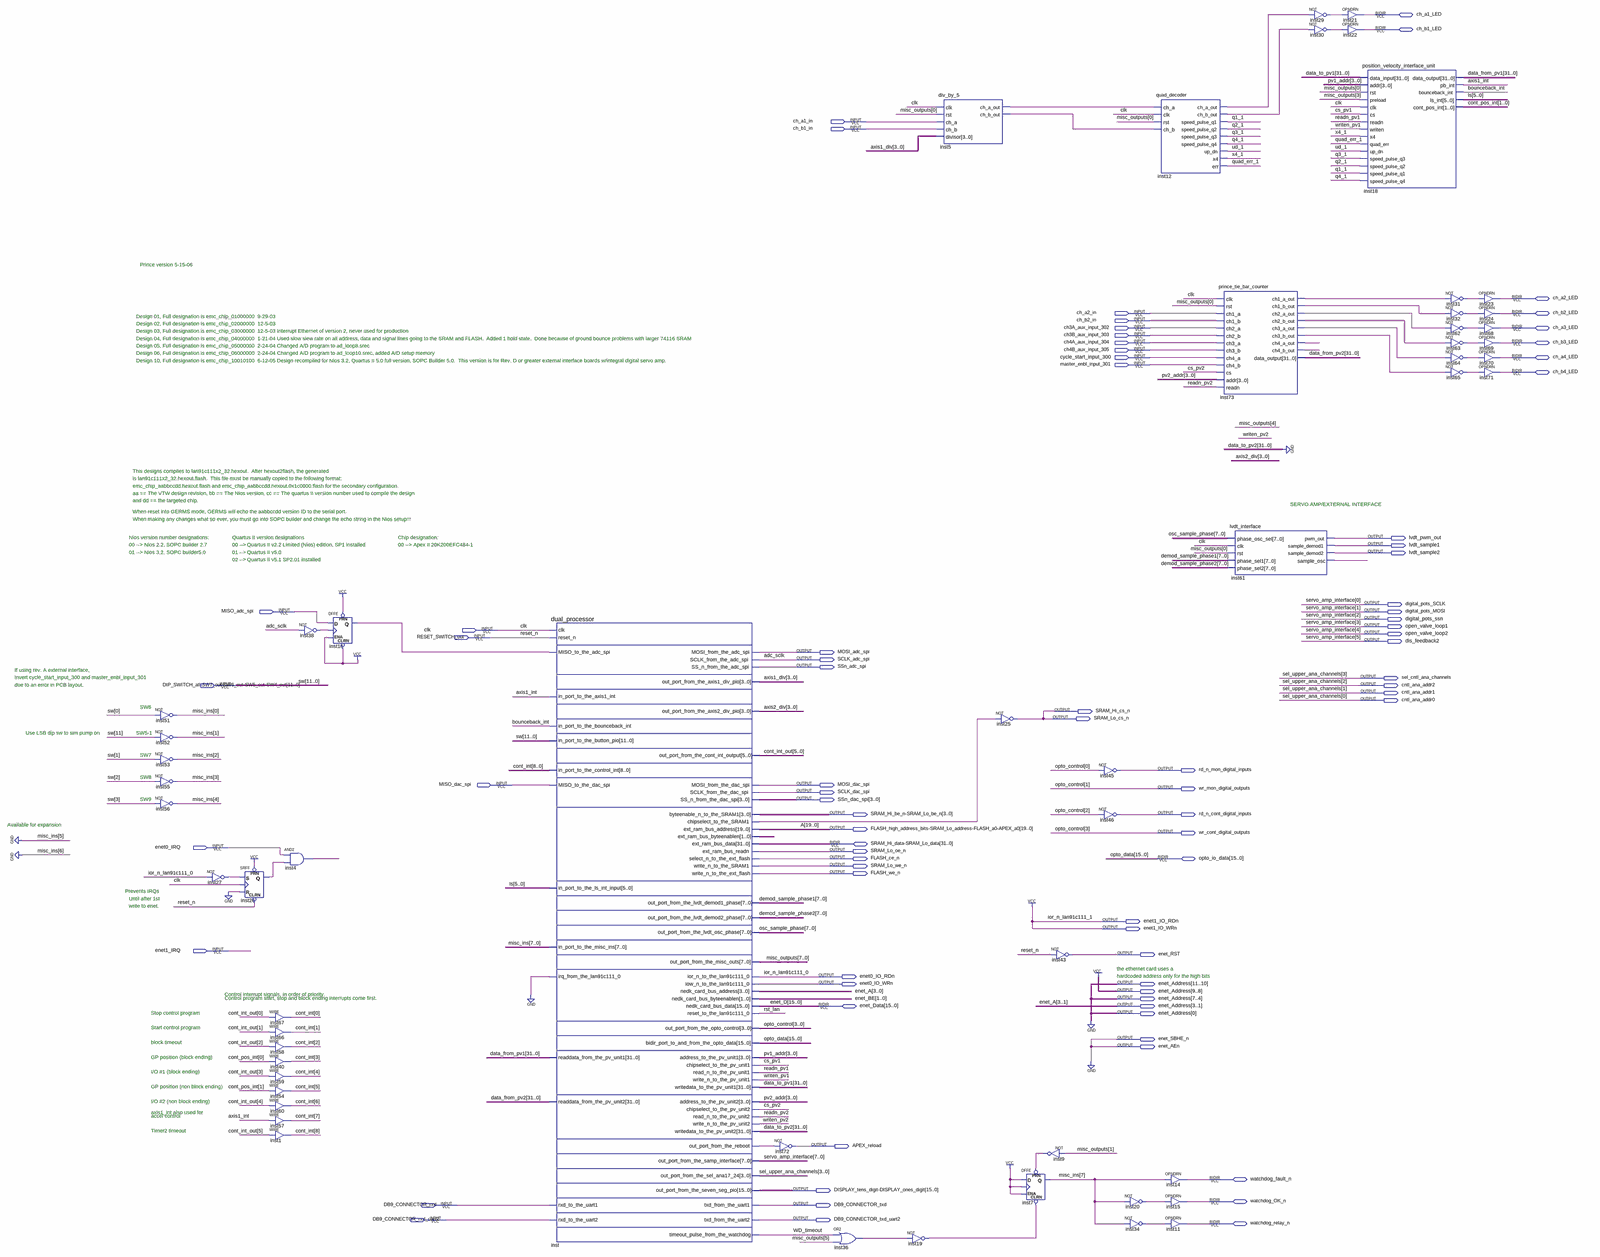
[diagram p0: schematic sheet, whole]
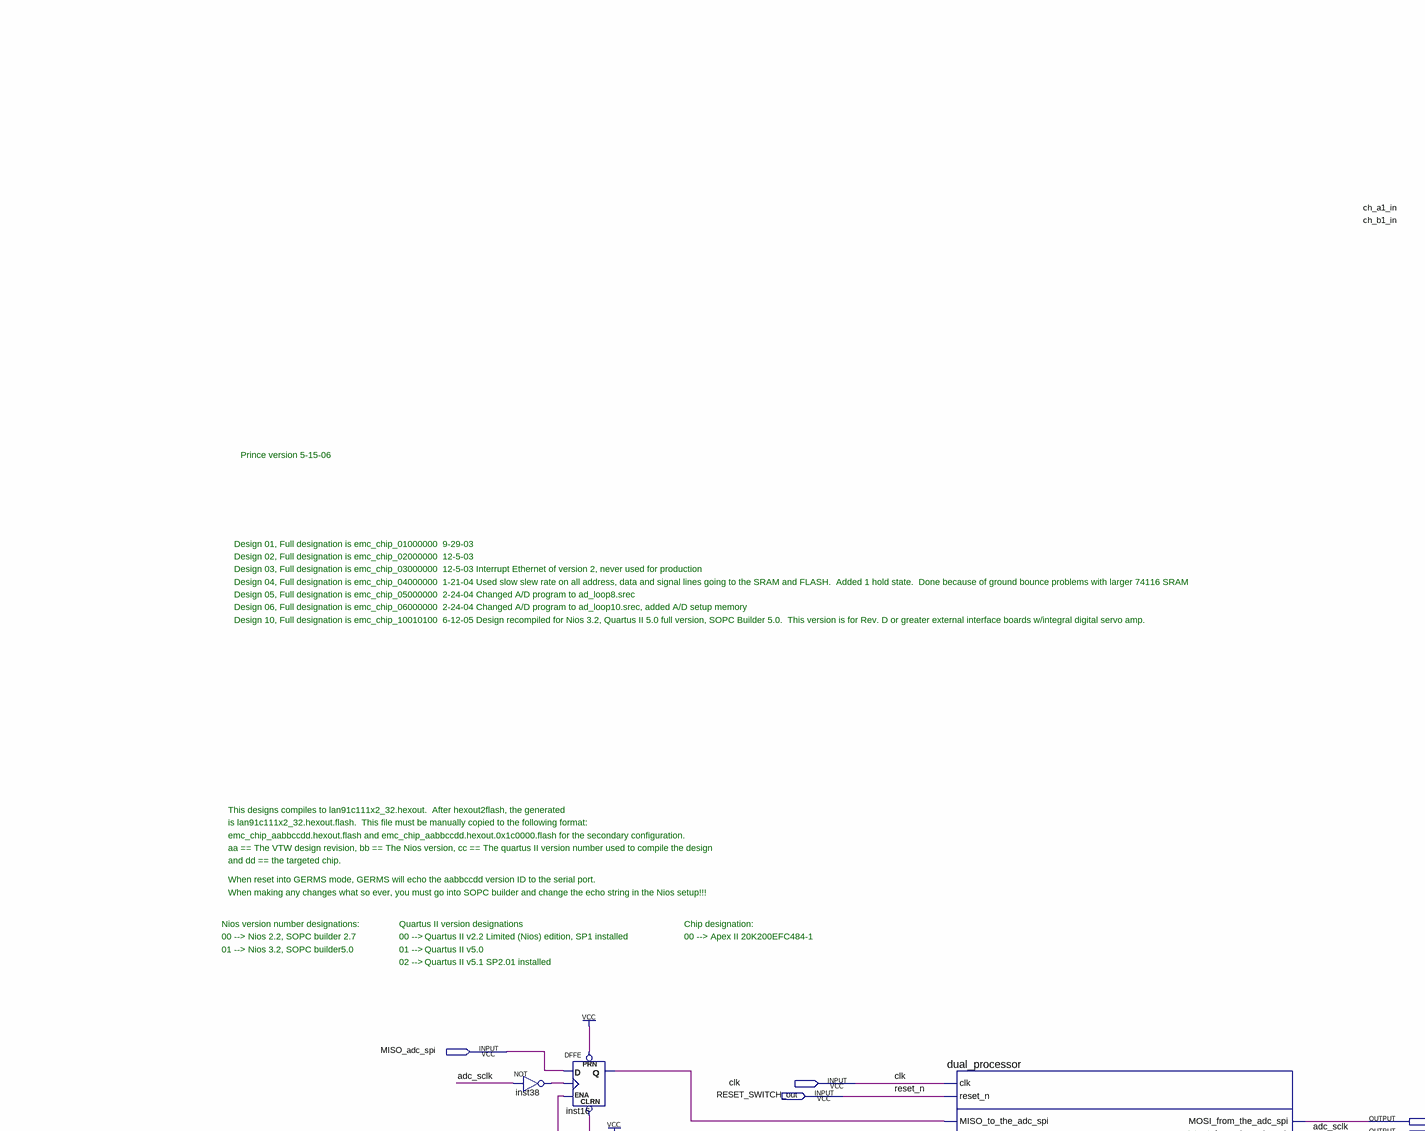
[diagram p1: schematic sheet, upper left part]
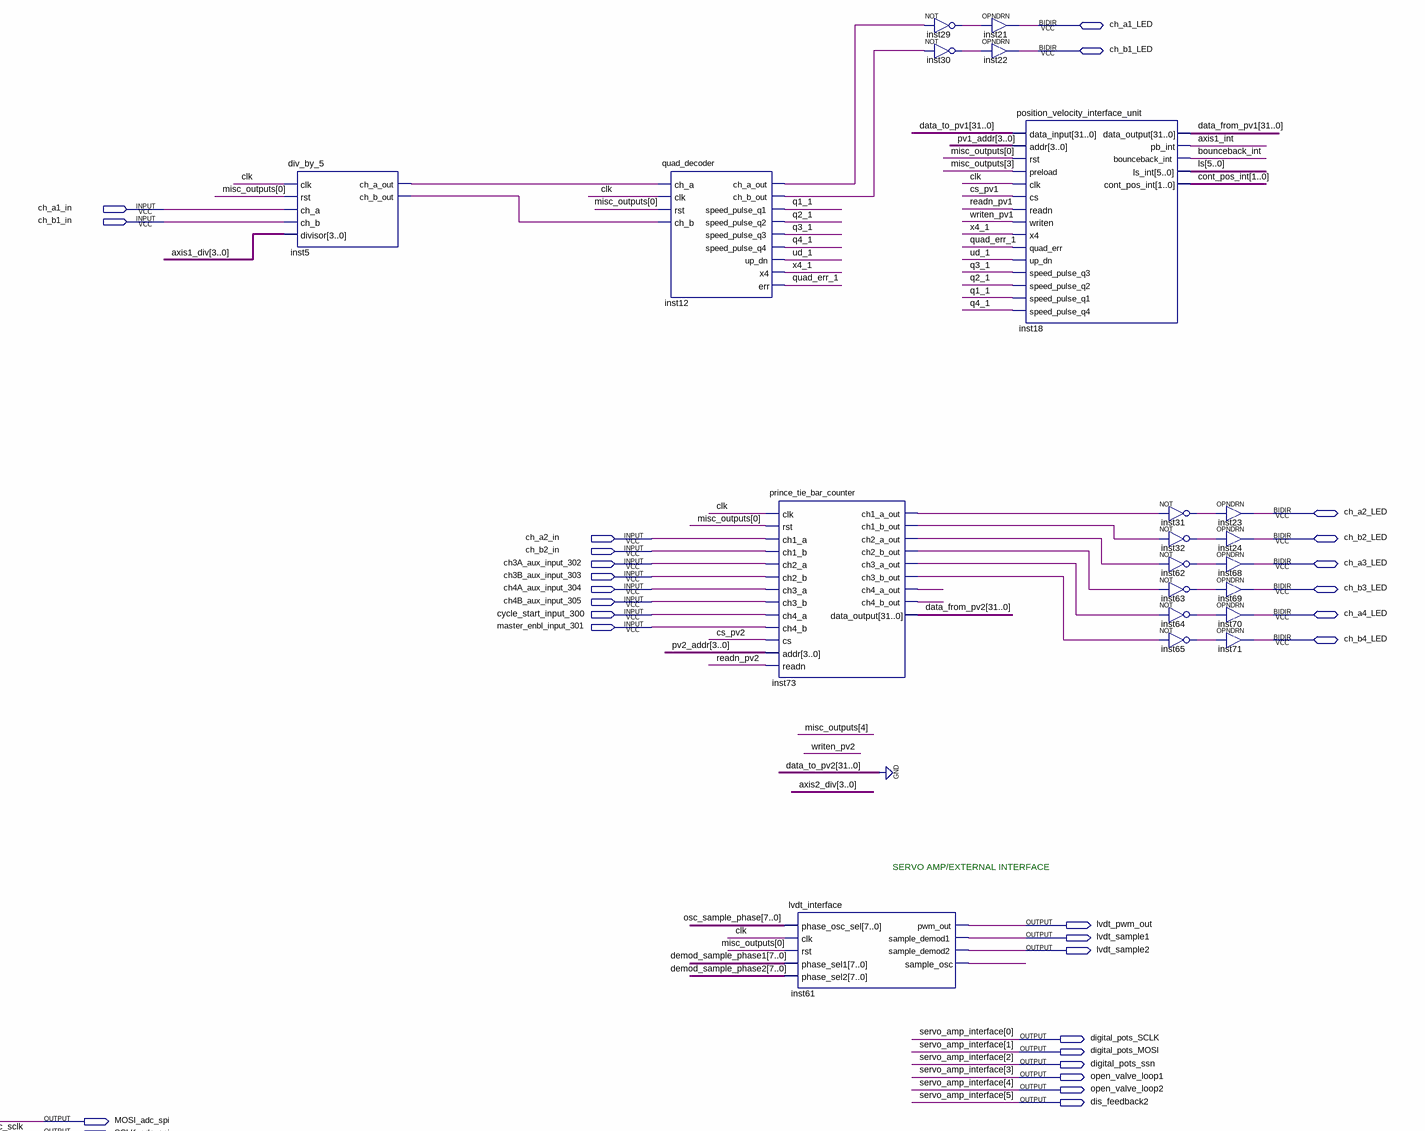
[diagram p2: schematic sheet, upper right part]
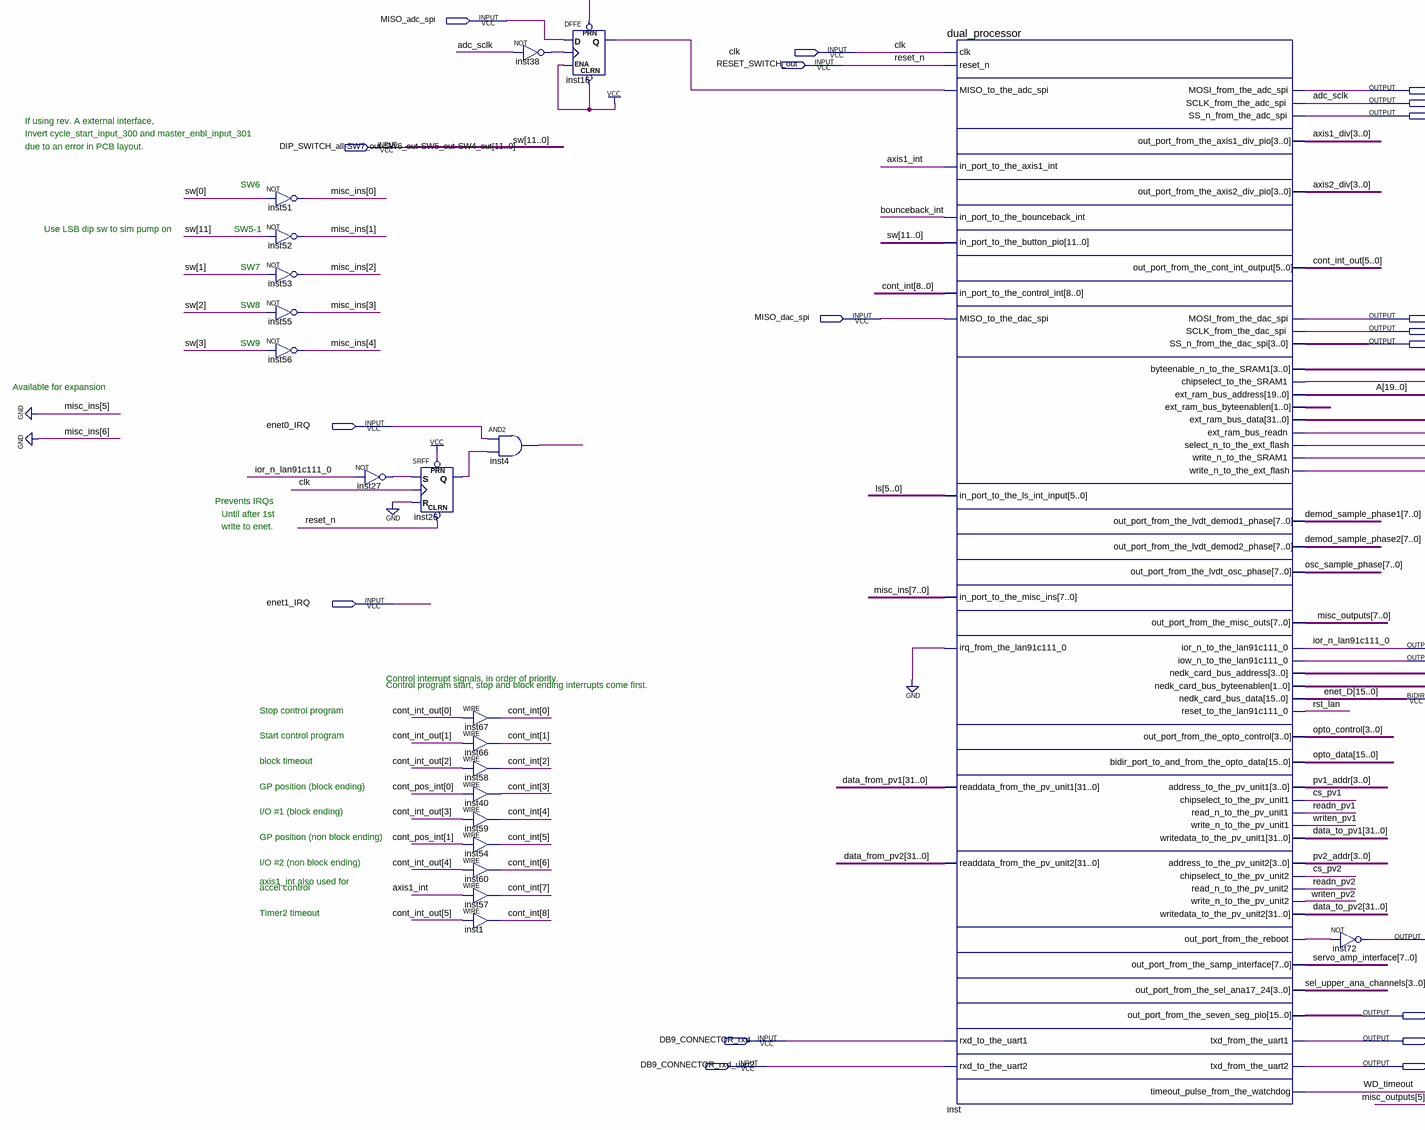
[diagram p3: schematic sheet, lower left part]
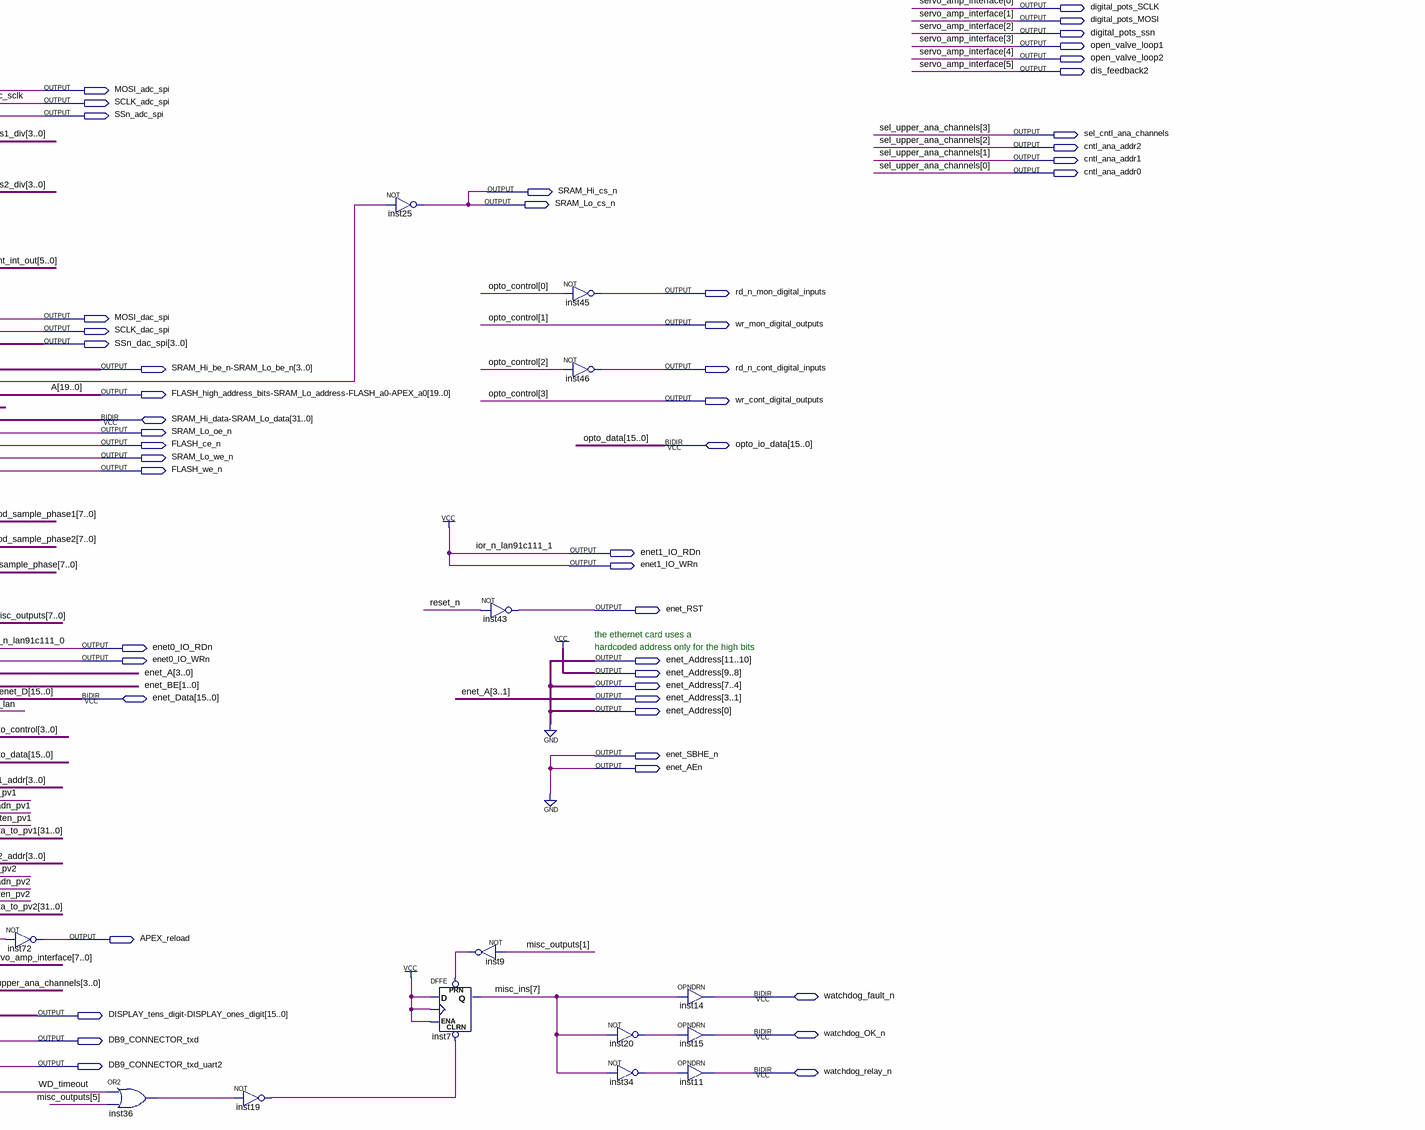
[diagram p4: schematic sheet, lower right part]
// Quartus schematic top_level_prince.bdf as structural Verilog: 55 symbols, 80 pins
module top_level_prince (
  input  ch_a1_in,
  input  ch_b1_in,
  input  ch_a2_in,
  input  ch_b2_in,
  input  ch3A_aux_input_302,
  input  ch3B_aux_input_303,
  input  ch4A_aux_input_304,
  input  ch4B_aux_input_305,
  input  cycle_start_input_300,
  input  master_enbl_input_301,
  input  MISO_adc_spi,
  input  clk,
  input  RESET_SWITCH_out,
  input  [11:0] \DIP_SWITCH_all-SW7_out-SW6_out-SW5_out-SW4_out ,
  input  MISO_dac_spi,
  input  enet0_IRQ,
  input  enet1_IRQ,
  input  DB9_CONNECTOR_rxd,
  input  DB9_CONNECTOR_rxd_uart2,
  inout  ch_a1_LED,
  inout  ch_b1_LED,
  inout  ch_a2_LED,
  inout  ch_b2_LED,
  inout  ch_a3_LED,
  inout  ch_b3_LED,
  inout  ch_a4_LED,
  inout  ch_b4_LED,
  inout  [31:0] \SRAM_Hi_data-SRAM_Lo_data ,
  inout  [15:0] opto_io_data,
  inout  [15:0] enet_Data,
  inout  watchdog_fault_n,
  inout  watchdog_OK_n,
  inout  watchdog_relay_n,
  output lvdt_pwm_out,
  output lvdt_sample1,
  output lvdt_sample2,
  output digital_pots_SCLK,
  output digital_pots_MOSI,
  output digital_pots_ssn,
  output open_valve_loop1,
  output open_valve_loop2,
  output dis_feedback2,
  output MOSI_adc_spi,
  output SCLK_adc_spi,
  output SSn_adc_spi,
  output sel_cntl_ana_channels,
  output cntl_ana_addr2,
  output cntl_ana_addr1,
  output cntl_ana_addr0,
  output SRAM_Hi_cs_n,
  output SRAM_Lo_cs_n,
  output rd_n_mon_digital_inputs,
  output MOSI_dac_spi,
  output wr_mon_digital_outputs,
  output SCLK_dac_spi,
  output [3:0] SSn_dac_spi,
  output [3:0] \SRAM_Hi_be_n-SRAM_Lo_be_n ,
  output rd_n_cont_digital_inputs,
  output [19:0] \FLASH_high_address_bits-SRAM_Lo_address-FLASH_a0-APEX_a0 ,
  output wr_cont_digital_outputs,
  output SRAM_Lo_oe_n,
  output FLASH_ce_n,
  output SRAM_Lo_we_n,
  output FLASH_we_n,
  output enet1_IO_RDn,
  output enet1_IO_WRn,
  output enet_RST,
  output enet0_IO_RDn,
  output enet0_IO_WRn,
  output [11:0] enet_Address,
  output enet_SBHE_n,
  output enet_AEn,
  output APEX_reload,
  output [15:0] \DISPLAY_tens_digit-DISPLAY_ones_digit ,
  output DB9_CONNECTOR_txd,
  output DB9_CONNECTOR_txd_uart2
);

  wire axis1_int, bounceback_int, cs_pv1, cs_pv2, inst4_out, inst5_ch_a_out, inst5_ch_b_out, inst9_out,
       inst12_ch_a_out, inst12_ch_b_out, inst16_q, inst19_out, inst20_out, inst26_q, inst27_out, inst29_out,
       inst30_out, inst31_out, inst32_out, inst34_out, inst36_out, inst38_out, inst61_sample_osc, inst62_out,
       inst63_out, inst64_out, inst65_out, inst73_ch1_a_out, inst73_ch1_b_out, inst73_ch2_a_out,
       inst73_ch2_b_out, inst73_ch3_a_out, inst73_ch3_b_out, inst73_ch4_a_out, inst73_ch4_b_out,
       inst_chipselect_to_the_sram1, inst_out_port_from_the_reboot, q1_1, q2_1, q3_1, q4_1, quad_err_1,
       readn_pv1, readn_pv2, rst_lan, ud_1, WD_timeout, writen_pv1, writen_pv2, x4_1;
  wire [0:0] enet_A;
  wire [1:0] cont_pos_int, enet_BE, inst_ext_ram_bus_byteenablen;
  wire [2:0] opto_control;
  wire [3:0] axis1_div, axis2_div, pv1_addr, pv2_addr;
  wire [5:0] cont_int_out, ls;
  wire [7:0] demod_sample_phase1, demod_sample_phase2, misc_ins, misc_outputs, osc_sample_phase;
  wire [7:6] servo_amp_interface;
  wire [8:0] cont_int;
  wire [31:0] data_from_pv1, data_from_pv2, data_to_pv1, data_to_pv2;

  not inst51 (misc_ins[0], \DIP_SWITCH_all-SW7_out-SW6_out-SW5_out-SW4_out [0]);
  not inst52 (misc_ins[1], \DIP_SWITCH_all-SW7_out-SW6_out-SW5_out-SW4_out [11]);
  not inst53 (misc_ins[2], \DIP_SWITCH_all-SW7_out-SW6_out-SW5_out-SW4_out [1]);
  not inst55 (misc_ins[3], \DIP_SWITCH_all-SW7_out-SW6_out-SW5_out-SW4_out [2]);
  not inst56 (misc_ins[4], \DIP_SWITCH_all-SW7_out-SW6_out-SW5_out-SW4_out [3]);
  not inst27 (inst27_out, enet0_IO_RDn);
  SRFF inst26 (.PRN(1'b1), .CLRN(RESET_SWITCH_out), .S(inst27_out), .R(1'b0), .CLK(clk), .Q(inst26_q));
  and inst4 (inst4_out, enet0_IRQ, inst26_q);
  assign cont_int[0] = cont_int_out[0];  // WIRE inst67
  assign cont_int[1] = cont_int_out[1];  // WIRE inst66
  assign cont_int[2] = cont_int_out[2];  // WIRE inst58
  assign cont_int[3] = cont_pos_int[0];  // WIRE inst40
  assign cont_int[4] = cont_int_out[3];  // WIRE inst59
  assign cont_int[5] = cont_pos_int[1];  // WIRE inst54
  assign cont_int[6] = cont_int_out[4];  // WIRE inst60
  assign cont_int[7] = axis1_int;  // WIRE inst57
  assign cont_int[8] = cont_int_out[5];  // WIRE inst1
  not inst38 (inst38_out, SCLK_adc_spi);
  DFFE inst16 (.PRN(1'b1), .CLRN(1'b1), .D(MISO_adc_spi), .CLK(inst38_out), .ENA(1'b1), .Q(inst16_q));
  dual_processor inst (
    .clk(clk), .reset_n(RESET_SWITCH_out), .MISO_to_the_adc_spi(inst16_q),
    .in_port_to_the_axis1_int(axis1_int), .in_port_to_the_bounceback_int(bounceback_int),
    .in_port_to_the_button_pio(\DIP_SWITCH_all-SW7_out-SW6_out-SW5_out-SW4_out ),
    .in_port_to_the_control_int(cont_int), .MISO_to_the_dac_spi(MISO_dac_spi),
    .in_port_to_the_ls_int_input(ls), .in_port_to_the_misc_ins({misc_ins[7], 2'b00, misc_ins[4:0]}),
    .irq_from_the_lan91c111_0(1'b0), .readdata_from_the_pv_unit1(data_from_pv1),
    .readdata_from_the_pv_unit2(data_from_pv2), .rxd_to_the_uart1(DB9_CONNECTOR_rxd),
    .rxd_to_the_uart2(DB9_CONNECTOR_rxd_uart2), .MOSI_from_the_adc_spi(MOSI_adc_spi),
    .SCLK_from_the_adc_spi(SCLK_adc_spi), .SS_n_from_the_adc_spi(SSn_adc_spi),
    .out_port_from_the_axis1_div_pio(axis1_div), .out_port_from_the_axis2_div_pio(axis2_div),
    .out_port_from_the_cont_int_output(cont_int_out), .MOSI_from_the_dac_spi(MOSI_dac_spi),
    .SCLK_from_the_dac_spi(SCLK_dac_spi), .SS_n_from_the_dac_spi(SSn_dac_spi),
    .byteenable_n_to_the_SRAM1(\SRAM_Hi_be_n-SRAM_Lo_be_n ),
    .chipselect_to_the_SRAM1(inst_chipselect_to_the_sram1),
    .ext_ram_bus_address(\FLASH_high_address_bits-SRAM_Lo_address-FLASH_a0-APEX_a0 ),
    .ext_ram_bus_byteenablen(inst_ext_ram_bus_byteenablen), .ext_ram_bus_readn(SRAM_Lo_oe_n),
    .select_n_to_the_ext_flash(FLASH_ce_n), .write_n_to_the_SRAM1(SRAM_Lo_we_n),
    .write_n_to_the_ext_flash(FLASH_we_n), .out_port_from_the_lvdt_demod1_phase(demod_sample_phase1),
    .out_port_from_the_lvdt_demod2_phase(demod_sample_phase2),
    .out_port_from_the_lvdt_osc_phase(osc_sample_phase), .out_port_from_the_misc_outs(misc_outputs),
    .ior_n_to_the_lan91c111_0(enet0_IO_RDn), .iow_n_to_the_lan91c111_0(enet0_IO_WRn),
    .nedk_card_bus_address({enet_Address[3:1], enet_A[0]}), .nedk_card_bus_byteenablen(enet_BE),
    .reset_to_the_lan91c111_0(rst_lan),
    .out_port_from_the_opto_control({wr_cont_digital_outputs, opto_control[2], wr_mon_digital_outputs, opto_control[0]}),
    .address_to_the_pv_unit1(pv1_addr), .chipselect_to_the_pv_unit1(cs_pv1),
    .read_n_to_the_pv_unit1(readn_pv1), .write_n_to_the_pv_unit1(writen_pv1),
    .writedata_to_the_pv_unit1(data_to_pv1), .address_to_the_pv_unit2(pv2_addr),
    .chipselect_to_the_pv_unit2(cs_pv2), .read_n_to_the_pv_unit2(readn_pv2),
    .write_n_to_the_pv_unit2(writen_pv2), .writedata_to_the_pv_unit2(data_to_pv2),
    .out_port_from_the_reboot(inst_out_port_from_the_reboot),
    .out_port_from_the_samp_interface({servo_amp_interface, dis_feedback2, open_valve_loop2, open_valve_loop1, digital_pots_ssn, digital_pots_MOSI, digital_pots_SCLK}),
    .out_port_from_the_sel_ana17_24({sel_cntl_ana_channels, cntl_ana_addr2, cntl_ana_addr1, cntl_ana_addr0}),
    .out_port_from_the_seven_seg_pio(\DISPLAY_tens_digit-DISPLAY_ones_digit ),
    .txd_from_the_uart1(DB9_CONNECTOR_txd), .txd_from_the_uart2(DB9_CONNECTOR_txd_uart2),
    .timeout_pulse_from_the_watchdog(WD_timeout), .ext_ram_bus_data(\SRAM_Hi_data-SRAM_Lo_data ),
    .nedk_card_bus_data(enet_Data), .bidir_port_to_and_from_the_opto_data(opto_io_data));
  not inst72 (APEX_reload, inst_out_port_from_the_reboot);
  or inst36 (inst36_out, WD_timeout, misc_outputs[5]);
  not inst19 (inst19_out, inst36_out);
  div_by_5 inst5 (
    .clk(clk), .rst(misc_outputs[0]), .ch_a(ch_a1_in), .ch_b(ch_b1_in), .divisor(axis1_div),
    .ch_a_out(inst5_ch_a_out), .ch_b_out(inst5_ch_b_out));
  not inst25 (SRAM_Hi_cs_n, inst_chipselect_to_the_sram1);
  DFFE inst7 (.PRN(inst9_out), .CLRN(inst19_out), .D(1'b1), .CLK(1'b1), .ENA(1'b1), .Q(misc_ins[7]));
  not inst43 (enet_RST, RESET_SWITCH_out);
  not inst9 (inst9_out, misc_outputs[1]);
  not inst45 (rd_n_mon_digital_inputs, opto_control[0]);
  not inst46 (rd_n_cont_digital_inputs, opto_control[2]);
  not inst20 (inst20_out, misc_ins[7]);
  not inst34 (inst34_out, misc_ins[7]);
  quad_decoder inst12 (
    .ch_a(inst5_ch_a_out), .clk(clk), .rst(misc_outputs[0]), .ch_b(inst5_ch_b_out),
    .ch_a_out(inst12_ch_a_out), .ch_b_out(inst12_ch_b_out), .speed_pulse_q1(q1_1), .speed_pulse_q2(q2_1),
    .speed_pulse_q3(q3_1), .speed_pulse_q4(q4_1), .up_dn(ud_1), .x4(x4_1), .err(quad_err_1));
  OPNDRN inst14 (.IN(misc_ins[7]), .OUT(watchdog_fault_n));
  OPNDRN inst15 (.IN(inst20_out), .OUT(watchdog_OK_n));
  OPNDRN inst11 (.IN(inst34_out), .OUT(watchdog_relay_n));
  prince_tie_bar_counter inst73 (
    .clk(clk), .rst(misc_outputs[0]), .ch1_a(ch_a2_in), .ch1_b(ch_b2_in), .ch2_a(ch3A_aux_input_302),
    .ch2_b(ch3B_aux_input_303), .ch3_a(ch4A_aux_input_304), .ch3_b(ch4B_aux_input_305),
    .ch4_a(cycle_start_input_300), .ch4_b(master_enbl_input_301), .cs(cs_pv2), .addr(pv2_addr),
    .readn(readn_pv2), .ch1_a_out(inst73_ch1_a_out), .ch1_b_out(inst73_ch1_b_out),
    .ch2_a_out(inst73_ch2_a_out), .ch2_b_out(inst73_ch2_b_out), .ch3_a_out(inst73_ch3_a_out),
    .ch3_b_out(inst73_ch3_b_out), .ch4_a_out(inst73_ch4_a_out), .ch4_b_out(inst73_ch4_b_out),
    .data_output(data_from_pv2));
  lvdt_interface inst61 (
    .phase_osc_sel(osc_sample_phase), .clk(clk), .rst(misc_outputs[0]), .phase_sel1(demod_sample_phase1),
    .phase_sel2(demod_sample_phase2), .pwm_out(lvdt_pwm_out), .sample_demod1(lvdt_sample1),
    .sample_demod2(lvdt_sample2), .sample_osc(inst61_sample_osc));
  not inst29 (inst29_out, inst12_ch_a_out);
  not inst30 (inst30_out, inst12_ch_b_out);
  OPNDRN inst21 (.IN(inst29_out), .OUT(ch_a1_LED));
  OPNDRN inst22 (.IN(inst30_out), .OUT(ch_b1_LED));
  position_velocity_interface_unit inst18 (
    .data_input(data_to_pv1), .addr(pv1_addr), .rst(misc_outputs[0]), .preload(misc_outputs[3]), .clk(clk),
    .cs(cs_pv1), .readn(readn_pv1), .writen(writen_pv1), .x4(x4_1), .quad_err(quad_err_1), .up_dn(ud_1),
    .speed_pulse_q3(q3_1), .speed_pulse_q2(q2_1), .speed_pulse_q1(q1_1), .speed_pulse_q4(q4_1),
    .data_output(data_from_pv1), .pb_int(axis1_int), .bounceback_int(bounceback_int), .ls_int(ls),
    .cont_pos_int(cont_pos_int));
  not inst31 (inst31_out, inst73_ch1_a_out);
  not inst32 (inst32_out, inst73_ch1_b_out);
  not inst62 (inst62_out, inst73_ch2_a_out);
  not inst63 (inst63_out, inst73_ch2_b_out);
  not inst64 (inst64_out, inst73_ch3_a_out);
  not inst65 (inst65_out, inst73_ch3_b_out);
  OPNDRN inst23 (.IN(inst31_out), .OUT(ch_a2_LED));
  OPNDRN inst24 (.IN(inst32_out), .OUT(ch_b2_LED));
  OPNDRN inst68 (.IN(inst62_out), .OUT(ch_a3_LED));
  OPNDRN inst69 (.IN(inst63_out), .OUT(ch_b3_LED));
  OPNDRN inst70 (.IN(inst64_out), .OUT(ch_a4_LED));
  OPNDRN inst71 (.IN(inst65_out), .OUT(ch_b4_LED));

  assign enet1_IO_RDn = 1'b1;
  assign enet1_IO_WRn = 1'b1;
  assign enet_Address[11:4] = 8'b00110000;
  assign enet_AEn = 1'b0;
  assign enet_SBHE_n = 1'b0;
  assign SRAM_Lo_cs_n = SRAM_Hi_cs_n;
  // also tied to GND on the sheet: {data_to_pv2[0], data_to_pv2[1], data_to_pv2[2], data_to_pv2[3], data_to_pv2[4], data_to_pv2[5], data_to_pv2[6], data_to_pv2[7], data_to_pv2[8], data_to_pv2[9], data_to_pv2[10], data_to_pv2[11], data_to_pv2[12], data_to_pv2[13], data_to_pv2[14], data_to_pv2[15], data_to_pv2[16], data_to_pv2[17], data_to_pv2[18], data_to_pv2[19], data_to_pv2[20], data_to_pv2[21], data_to_pv2[22], data_to_pv2[23], data_to_pv2[24], data_to_pv2[25], data_to_pv2[26], data_to_pv2[27], data_to_pv2[28], data_to_pv2[29], data_to_pv2[30], data_to_pv2[31]}

  // Other names for the same wires on the sheet: A[19:0] = \FLASH_high_address_bits-SRAM_Lo_address-FLASH_a0-APEX_a0 ;
  //   adc_sclk = SCLK_adc_spi; enet_A[3:1] = enet_Address[3:1]; enet_D[15:0] = enet_Data;
  //   ior_n_lan91c111_0 = enet0_IO_RDn; opto_control (some bits) = {wr_cont_digital_outputs, wr_mon_digital_outputs};
  //   opto_data[15:0] = opto_io_data; reset_n = RESET_SWITCH_out;
  //   sel_upper_ana_channels[3:0] = {sel_cntl_ana_channels, cntl_ana_addr2, cntl_ana_addr1, cntl_ana_addr0};
  //   servo_amp_interface[5:0] = {dis_feedback2, open_valve_loop2, open_valve_loop1, digital_pots_ssn, digital_pots_MOSI, digital_pots_SCLK};
  //   sw[11:0] = \DIP_SWITCH_all-SW7_out-SW6_out-SW5_out-SW4_out 

  // Notes on the sheet:
  //   Prince version 5-15-06
  //   Design 01, Full designation is emc_chip_01000000  9-29-03
  //   Design 02, Full designation is emc_chip_02000000  12-5-03
  //   Design 03, Full designation is emc_chip_03000000  12-5-03 Interrupt Ethernet of version 2, never used for production
  //   Design 04, Full designation is emc_chip_04000000  1-21-04 Used slow slew rate on all address, data and signal lines going to the SRAM and FLASH.  Added 1 hold state.  Done because of ground bounce problems with larger 74116 SRAM
  //   Design 05, Full designation is emc_chip_05000000  2-24-04 Changed A/D program to ad_loop8.srec
  //   Design 06, Full designation is emc_chip_06000000  2-24-04 Changed A/D program to ad_loop10.srec, added A/D setup memory
  //   Design 10, Full designation is emc_chip_10010100  6-12-05 Design recompiled for Nios 3.2, Quartus II 5.0 full version, SOPC Builder 5.0.  This version is for Rev. D or greater external interface boards w/integral digital servo amp.
  //   This designs compiles to lan91c111x2_32.hexout.  After hexout2flash, the generated
  //   is lan91c111x2_32.hexout.flash.  This file must be manually copied to the following format:
  //   emc_chip_aabbccdd.hexout.flash and emc_chip_aabbccdd.hexout.0x1c0000.flash for the secondary configuration.
  //   aa == The VTW design revision, bb == The Nios version, cc == The quartus II version number used to compile the design
  //   and dd == the targeted chip.
  //   SERVO AMP/EXTERNAL INTERFACE
  //   When reset into GERMS mode, GERMS will echo the aabbccdd version ID to the serial port.
  //   When making any changes what so ever, you must go into SOPC builder and change the echo string in the Nios setup!!!
  //   Nios version number designations:
  //   Quartus II version designations
  //   Chip designation:
  //   00 --> Nios 2.2, SOPC builder 2.7
  //   00 -->
  //   Quartus II v2.2 Limited (Nios) edition, SP1 installed
  //   00 --> Apex II 20K200EFC484-1
  //   01 --> Nios 3.2, SOPC builder5.0
  //   01 -->
  //   Quartus II v5.0
  //   02 -->
  //   Quartus II v5.1 SP2.01 installed
  //   If using rev. A external interface,
  //   Invert cycle_start_input_300 and master_enbl_input_301
  //   due to an error in PCB layout.
  //   SW6
  //   Use LSB dip sw to sim pump on
  //   SW5-1
  //   SW7
  //   SW8
  //   SW9
  //   Available for expansion
  //   Prevents IRQs
  //   Until after 1st
  //   write to enet.
  //   the ethernet card uses a
  //   hardcoded address only for the high bits
  //   Control interrupt signals, in order of priority.
  //   Control program start, stop and block ending interrupts come first.
  //   Stop control program
  //   Start control program
  //   block timeout
  //   GP position (block ending)
  //   I/O #1 (block ending)
  //   GP position (non block ending)
  //   I/O #2 (non block ending)
  //   axis1_int also used for
  //   accel control
  //   Timer2 timeout
endmodule
